# EAGLE design 411_SCH_FINAL (EAGLE 9.2.2)
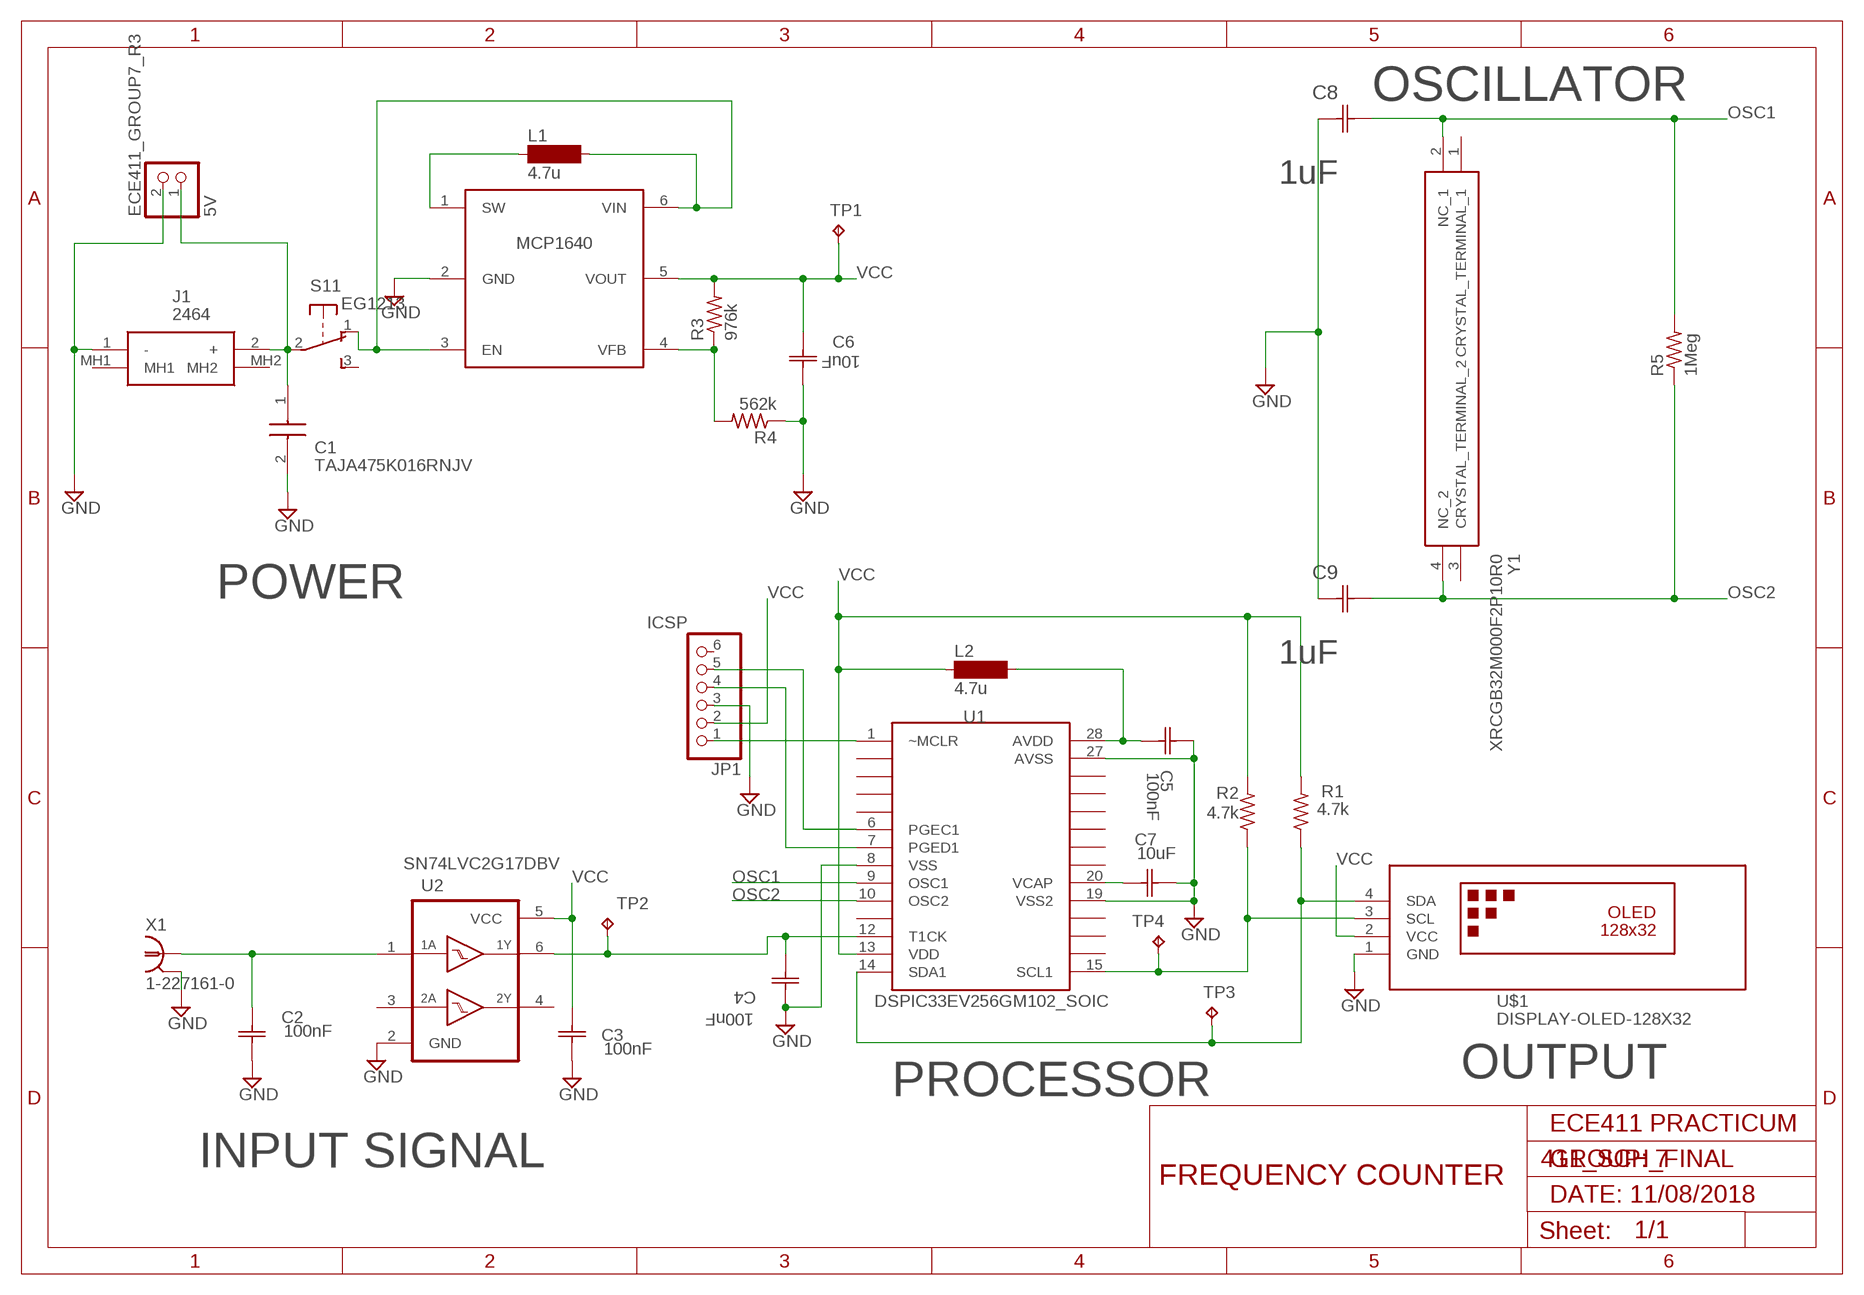
[diagram p0: schematic, sheet 1]

## Parts
C1  TAJA475K016RNJV  [CAPPM3216X180N]
C2  100nF  C0805C104K5RACTU  [CAPC2013X110N]
C3  100nF  C0805C104K5RACTU  [CAPC2013X110N]
C4  100nF  C0805C104K5RACTU  [CAPC2013X110N]
C5  100nF  C0805C104K5RACTU  [CAPC2013X110N]
C6  10uF  C0805C106K4PACTU  [CAPC2013X140N]
C7  10uF  C0805C106K4PACTU  [CAPC2013X140N]
C8  1uF  C0805C105K4RACTU  [CAPC2013X110N]
C9  1uF  C0805C105K4RACTU  [CAPC2013X110N]
ECE411_GROUP7_R3  5V  JST_2PIN-THM-RA  [JST-PH-2-THM-RA]
J1  2464  [2464]
JP1  ICSP  PINHD-1X6  [1X06]
L1  4.7u  SM-1206  [SM-1206]
L2  4.7u  SM-1206  [SM-1206]
MCP1  MCP1640  [SOP95P270X145-6]
R1  4.7k  R-US_M2012  [M2012]
R2  4.7k  R-US_M2012  [M2012]
R3  976k  R-US_R0805  [R0805]
R4  562k  R-US_R0805  [R0805]
R5  1Meg  R-US_M0805  [M0805]
S1  EG1213  [EG1213]
TP1  TPB1,27  [B1,27]
TP2  TPB1,27  [B1,27]
TP3  TPB1,27  [B1,27]
TP4  TPB1,27  [B1,27]
U1  DSPIC33EV256GM102_SOIC  [SOIC127P1020X265-28]
U2  SN74LVC2G17DBV  [SOT23-6]
U$1  DISPLAY-OLED-128X32  [DISPLAY-OLED-128X32]
X1  1-227161-0  [AMP_227161]
Y1  XRCGB32M000F2P10R0  [XRCGB32_F]

## Nets
BATT: L1.2 MCP1.3(EN) MCP1.6(VIN) S1.1(1:O)
GND: C1.2(-) C2.2(C2) C3.2(C2) C4.2(C2) C5.1(C1) C6.2(C2) C7.2(C2) C8.1(C1) C9.1(C1) ECE411_GROUP7_R3.2 J1.1(-) JP1.3 MCP1.2(GND) R4.1 U1.8(VSS) U1.19(VSS2) U1.27(AVSS) U2.2(GND) U$1.1(GND) X1.2
N$1: C7.1(C1) U1.20(VCAP)
N$2: C1.1(+) ECE411_GROUP7_R3.1 J1.2(+) S1.2(1:P)
N$5: R1.1 TP3.TP U1.14(SDA1) U$1.4(SDA)
N$6: C2.1(C1) U2.1(1A) X1.1
N$10: C5.2(C2) L2.2 U1.28(AVDD)
N$11: L1.1 MCP1.1(SW)
N$12: MCP1.4(VFB) R3.1 R4.2
N$14: JP1.1 U1.1(~MCLR)
N$15: R2.1 TP4.TP U1.15(SCL1) U$1.3(SCL)
N$16: JP1.4 U1.7(PGED1)
N$17: JP1.5 U1.6(PGEC1)
N$20: C4.1(C1) TP2.TP U1.12(T1CK) U2.6(1Y)
OSC1: C8.2(C2) R5.2 U1.9(OSC1) Y1.2(NC_1)
OSC2: C9.2(C2) R5.1 U1.10(OSC2) Y1.4(NC_2)
VCC: C3.1(C1) C6.1(C1) JP1.2 L2.1 MCP1.5(VOUT) R1.2 R2.2 R3.2 TP1.TP U1.13(VDD) U2.5(VCC) U$1.2(VCC)
Unconnected: J1.MH1 J1.MH2 JP1.6 S1.3(1:S) S1.MT1(MT) S1.MT2(MT) U1.2 U1.3 U1.4 U1.5 U1.11 U1.16 U1.17 U1.18 U1.21 U1.22 U1.23 U1.24 U1.25 U1.26 U2.3(2A) U2.4(2Y) Y1.1(CRYSTAL_TERMINAL_1) Y1.3(CRYSTAL_TERMINAL_2)

## Notes on the sheet
- OSCILLATOR
- POWER
- OUTPUT
- PROCESSOR
- ECE411 PRACTICUM
- INPUT SIGNAL | GROUP: 7
- FREQUENCY COUNTER
- DATE: 11/08/2018

## Library data of the parts
C1 = SamacSys_Parts:TAJA475K016RNJV: Tantalum Capacitors - Solid SMD 16V 4.7uF 10% 1206 ESR = 4 Ohms Source: Datasheet <https://componentsearchengine.com/Datasheets/1/TAJA475K016RNJV.pdf>; DESCRIPTION: Tantalum Capacitors - Solid SMD 16V 4.7uF 10% 1206 ESR = 4 Ohms; HEIGHT: 1.8mm; MANUFACTURER_NAME: AVX; MANUFACTURER_PART_NUMBER: TAJA475K016RNJV; MOUSER_PART_NUMBER: 581-TAJA475K016RNJV
C2-C5 = Kemet_By_element14_Batch_1:C0805C104K5RACTU: CAPACITOR, 0805; MPN: C0805C104K5RACTU; OC_FARNELL: 1414664; OC_NEWARK: 65H7431; SUPPLIER: Kemet; TOLERANCE: ±10%; VOLTAGERATING: 50V
C6 C7 = Kemet_By_element14_Batch_1:C0805C106K4PACTU: CAPACITOR, 0805; MPN: C0805C106K4PACTU; OC_FARNELL: 1288204; OC_NEWARK: 13M6695; SUPPLIER: Kemet; TOLERANCE: ±10%; VOLTAGERATING: 16V
C8 C9 = Kemet_By_element14_Batch_1:C0805C105K4RACTU: CAPACITOR, 0805; MPN: C0805C105K4RACTU; OC_FARNELL: 9227792; OC_NEWARK: 77C5351; SUPPLIER: Kemet; TOLERANCE: ±10%; VOLTAGERATING: 16V
ECE411_GROUP7_R3 = adafruit:JST_2PIN: JST 2-Pin Connectors of various flavors SMT-RA (S2B-PH-SM4) 4UConnector #17311 SMT (B2B-PH-SM4) THM-RA (S2B-PH) THM (B2B-PH); COST: 0.11; MFG: Harwin Inc.; MPN: M20-9990246; VENDOR: Digikey
J1 = SamacSys_Parts:2464: KEYSTONE - 2464. - BATTERY HOLDER Source: Datasheet <https://componentsearchengine.com/Datasheets/1/2464.pdf>; DESCRIPTION: KEYSTONE - 2464. - BATTERY HOLDER; HEIGHT: 16mm; MANUFACTURER_NAME: Keystone Electronics; MANUFACTURER_PART_NUMBER: 2464; MOUSER_PART_NUMBER: 534-2464
JP1 = adafruit:PINHD-1X6: PIN HEADER; COST: 0
L1 L2 = inductor-neosid:SM-1206: INDUCTOR SMD chip inductor; OC_FARNELL: unknown; OC_NEWARK: unknown
MCP1 = WBlib:MCP1640: MCP1640; COST: 0.59; MFG: Microchip Technology; MPN: MCP1640DT-I/CHY; VENDOR: Digikey
R1 R2 = adafruit:R-US_: RESISTOR, American symbol; COST: 0.1; MFG: Bourns; MPN: CR1206-JW-114ELF; VENDOR: Mouser
R3-R5 = adafruit:R-US_: RESISTOR, American symbol
S1 = adafruit:EG1213: E-Switch right-angle slide SPDT Part #EG1213 http://www.ladyada.net/library/eagle
TP1-TP4 = testpad:TP: Test pad; COST: 0
U1 = WBlib:DSPIC33EV256GM102: Microchip dsPIC33EV256GM102; COST: 3.67; MFG: Microchip Technology; MPN: DSPIC33EV256GM102; VENDOR: Digikey
U2 = SN74LVC2G17:SN74LVC2G17: DUAL SCHMITT-TRIGGER BUFFER; AVAILABILITY: Unavailable; COST: 0.42; DESCRIPTION: Dual Schmitt-Trigger Buffer; MF: Texas Instruments; MFG: ON semiconductor; MP: SN74LVC2G17; MPN: NC7WZ14P6X; PACKAGE: XFDFN-6 Texas Instruments; PRICE: None; VENDOR: Digikey
U$1 = diy-modules:DISPLAY-OLED-128X32: 128x32 Dot Matrix OLED Module with I2C interface based on SSD1306 chip More details available here: http://www.tinyosshop.com/index.php?route=product/product&product_id=953 Schematic available here: http://www.tinyosshop.com/datasheet/OLED%2012832.pdf SSD1306 datasheet: https://cdn-shop.adafruit.com/datasheets/SSD1306.pdf Click here to find device on ebay.com <http://www.ebay.com/sch/oled+display+128x32+i2c>; COST: 5.50; MFG: Generic; MPN: SSD1306; VENDOR: Amazon
X1 = con-coax:?227161*: JACK, RIGHT ANGLE, 50 OHM, PCB, BNC Source: amp_227161.pdf; MF: TYCO ELECTRONICS; MPN: 1-227161; OC_FARNELL: unknown; OC_NEWARK: 33B3200
Y1 = SamacSys_Parts:XRCGB32M000F2P10R0: Crystals 32.0MHz 20ppm Tol. Temp Shift 20ppm Source: Datasheet <https://componentsearchengine.com/Datasheets/1/XRCGB32M000F2P10R0.pdf>; DESCRIPTION: Crystals 32.0MHz 20ppm Tol. Temp Shift 20ppm; HEIGHT: mm; MANUFACTURER_NAME: Murata Electronics; MANUFACTURER_PART_NUMBER: XRCGB32M000F2P10R0; MOUSER_PART_NUMBER: 81-XRCGB32M000F2P1R0

## Board
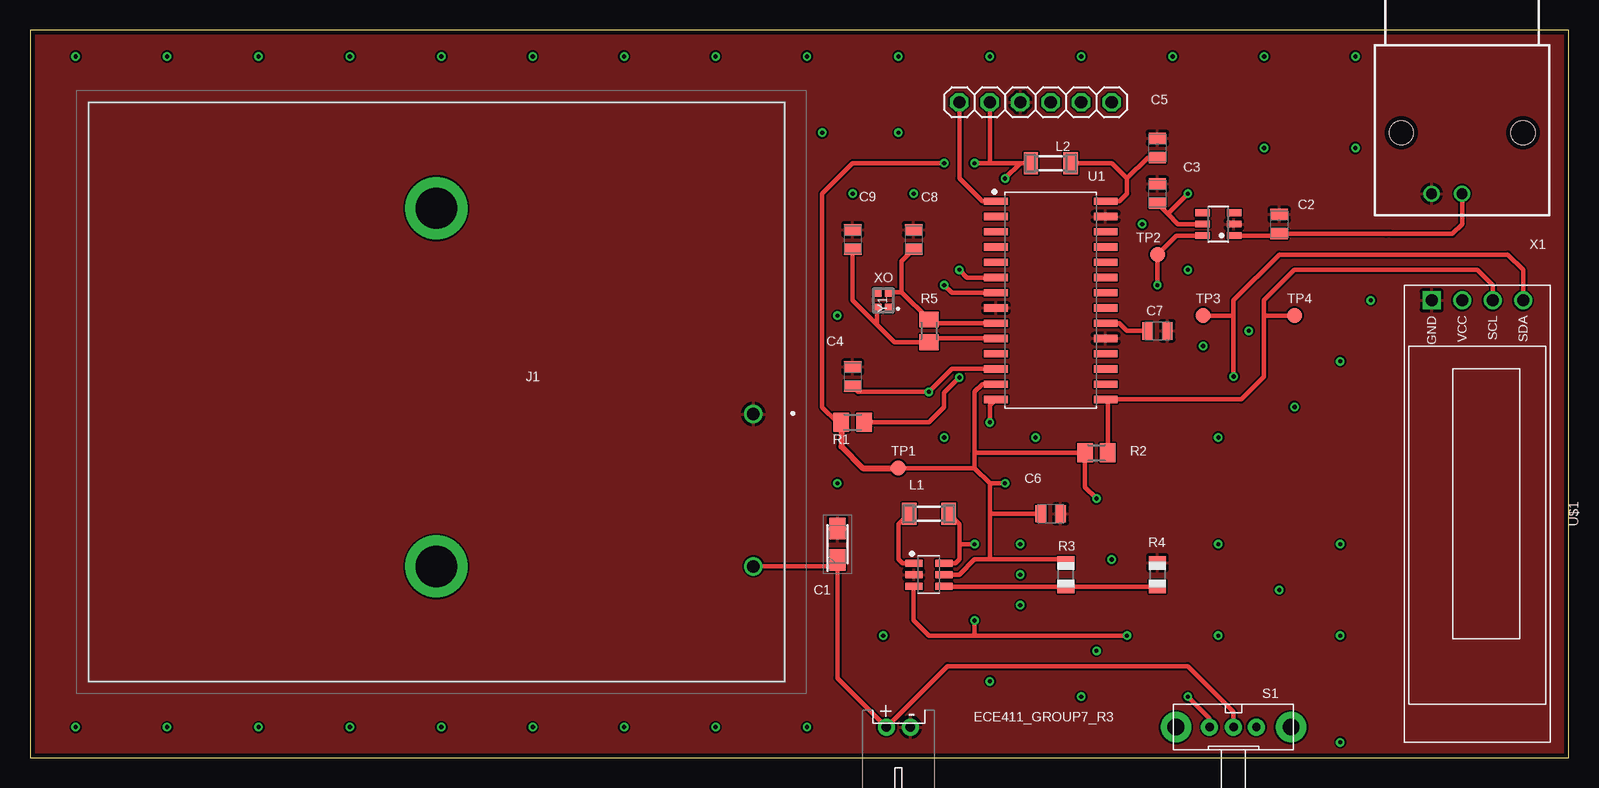
[diagram p1: board, top side]
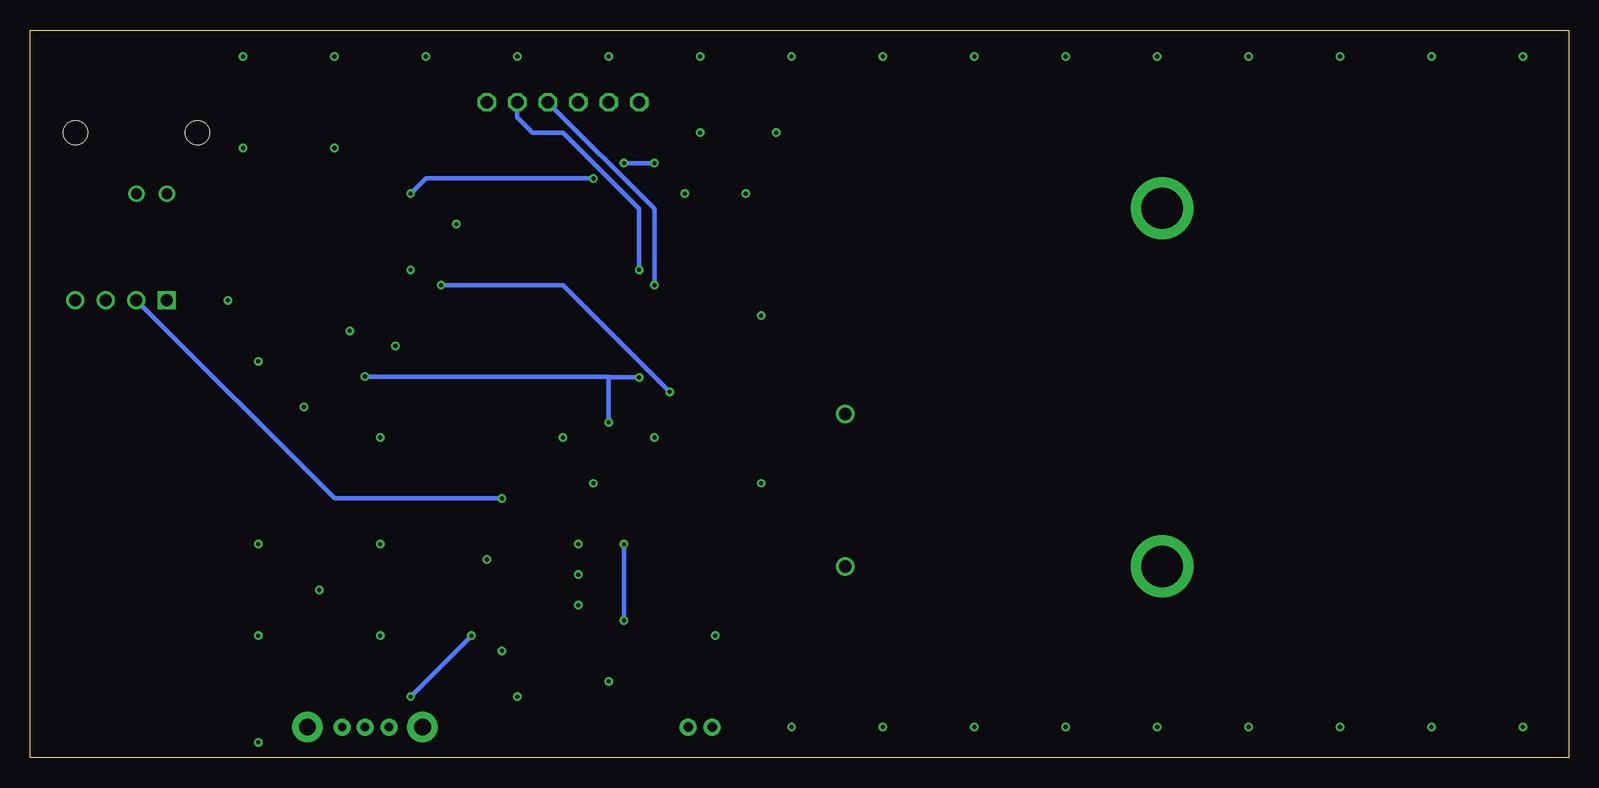
[diagram p2: board, bottom side, seen from below]

Size 128.25 x 60.63 mm. Coordinates in mm from the lower left corner, seen from the top.
Outline: 0,0 128.25,0 128.25,60.63 0,60.63 0,0
Copper layers (1*16): Top 0.0356mm / dielectric 1.5011mm / Bottom 0.0356mm
Design rules "LaenPCBOrder": minimum track width 6mil, minimum drill 13mil, track to track 6mil, track to pad 6mil, pad to pad 6mil, via to via 6mil, smd to smd 6mil, copper to edge 15mil, drill to drill 6mil, minimum pad ring 7mil, minimum via ring 7mil, stop-mask expansion 3mil, vias tented up to drill 0mil, thermal gap 10mil

### Footprints (pad centres in the part's own frame; a part is rotated, then mirrored left to right if it is on the bottom)
CAPPM3216X180N = smd 1.8 x 1.3: 1 -1.3,0; 2 1.3,0
CAPC2013X110N = smd 0.914 x 1.448: 1 -0.813,0; 2 0.813,0
CAPC2013X140N = smd 0.914 x 1.448: 1 -0.813,0; 2 0.813,0
JST-PH-2-THM-RA = drill 0.8 pad 1.422: 1 1,0; 2 -1,0
2464 = drill 1.02 pad 1.53: 1 26.005,-1.85; 2 26.005,-14.55 | drill 3.45 pad 5.175: MH1 -0.415,-14.55; MH2 -0.415,15.3
1X06 = drill 1.016 octagon: 1 -6.35,0; 2 -3.81,0; 3 -1.27,0; 4 1.27,0; 5 3.81,0; 6 6.35,0
SM-1206 = smd 1.2 x 1.8: 1 -1.65,0; 2 1.65,0
SOP95P270X145-6 = smd 1.412 x 0.59: 1 -1.247,0.95; 2 -1.247,0; 3 -1.247,-0.95; 4 1.247,-0.95; 5 1.247,0; 6 1.247,0.95
M2012 = smd 1.3 x 1.6: 1 -0.95,0; 2 0.95,0
R0805 = smd 1.1 x 1.4: 1 -1,0; 2 1,0
M0805 = smd 1.3 x 1.6: 1 -0.95,0; 2 0.95,0
EG1213 = drill 0.7 pad 1.422: 1 -2,0; 2 0,0; 3 1.9,0 | drill 1.4 pad 2.54: MT1 -4.8,0; MT2 4.8,0
B1,27 = smd 1.27 x 1.27: TP 0,0
SOIC127P1020X265-28 = smd 1.968 x 0.599: 1 -4.573,8.255; 2 -4.573,6.985; 3 -4.573,5.715; 4 -4.573,4.445; 5 -4.573,3.175; 6 -4.573,1.905; 7 -4.573,0.635; 8 -4.573,-0.635; 9 -4.573,-1.905; 10 -4.573,-3.175; 11 -4.573,-4.445; 12 -4.573,-5.715; 13 -4.573,-6.985; 14 -4.573,-8.255; 15 4.573,-8.255; 16 4.573,-6.985; 17 4.573,-5.715; 18 4.573,-4.445; 19 4.573,-3.175; 20 4.573,-1.905; 21 4.573,-0.635; 22 4.573,0.635; 23 4.573,1.905; 24 4.573,3.175; 25 4.573,4.445; 26 4.573,5.715; 27 4.573,6.985; 28 4.573,8.255
SOT23-6 = smd 0.55 x 1.2: 1 -0.95,-1.3; 2 0,-1.3; 3 0.95,-1.3; 4 0.95,1.3; 5 0,1.3; 6 -0.95,1.3
DISPLAY-OLED-128X32 = drill 1 square: 1 -17.78,-3.81 | drill 1: 2 -17.78,-1.27; 3 -17.78,1.27; 4 -17.78,3.81
AMP_227161 = drill 0.9 pad 1.27: 1 0,-5.08; 2 -2.54,-5.08 | hole 2: -5.08,0; 5.08,0
XRCGB32_F = smd 0.75 x 0.7: 1 -0.675,-0.5; 2 0.675,-0.5; 3 0.675,0.5; 4 -0.675,0.5

### Placement (x,y rotation side)
C1  67.31,17.78 90 top
C2  104.14,44.45 90 top
C3  93.98,46.99 90 top
C4  68.58,31.75 90 top
C5  93.98,50.8 270 top
C6  85.09,20.32 0 top
C7  93.98,35.56 0 top
C8  73.66,43.18 270 top
C9  68.58,43.18 270 top
ECE411_GROUP7_R3  72.39,2.54 180 top
J1  34.29,30.48 0 top
JP1  83.82,54.61 0 top
L1  74.93,20.32 0 top
L2  85.09,49.53 0 top
MCP1  74.93,15.24 0 top
R1  68.58,27.94 180 top
R2  88.9,25.4 180 top
R3  86.36,15.24 90 top
R4  93.98,15.24 270 top
R5  74.93,35.56 90 top
S1  100.33,2.54 0 top
TP1  72.39,24.13 0 top
TP2  93.98,41.91 0 top
TP3  97.79,36.83 0 top
TP4  105.41,36.83 0 top
U1  85.09,38.1 0 top
U2  99.06,44.45 90 top
U$1  120.65,20.32 270 top
X1  119.38,52.07 0 top
Y1  71.12,38.1 90 top

### Tracks (layer width: path | path; a pad name or v marks a point on that pad's centre or on a via)
BATT  (via drill 0.35)
  Top 0.356: MCP1.6 77.15,16.19 77.47,16.51 77.47,17.78 | L1.2 77.47,19.43 77.47,17.78 | S1.1 98.33,3.27 v96.52,5.08 | v91.44,10.16 78.74,10.16 | 78.74,10.16 74.93,10.16 73.66,11.43 73.66,14.27 MCP1.3 | 77.47,17.78 v78.74,17.78 | v78.74,11.43 78.74,10.16
  Bottom 0.356: v96.52,5.08 v91.44,10.16 | v78.74,17.78 v78.74,11.43
GND
  pour Top: -1.27,62.23 -1.27,-1.27 129.54,-1.27 129.54,62.23
N$1
  Top 0.356: U1.20 90.8,36.2 91.44,35.56 C7.1
N$2
  Top 0.356: J1.2 66.76,15.93 C1.1 67.31,6.62 ECE411_GROUP7_R3.1 76.47,7.62 96.52,7.62 100.33,3.81 S1.2
N$3  (via drill 0.35)
  other vias: 110.49,58.42
N$4  (via drill 0.35)
  other vias: 110.49,50.8
N$5  (via drill 0.35)
  Top 0.356: 100.33,36.83 100.33,38.1 104.14,41.91 123.19,41.91 124.46,40.64 U$1.4 | 100.33,36.83 v100.33,31.75 | TP3.TP 100.33,36.83 | U1.14 80.01,29.34 v80.01,27.94 | R1.1 74.93,27.94 76.2,29.21 76.2,30.41 v77.47,31.68
  Bottom 0.356: v100.33,31.75 80.01,31.75 | v80.01,27.94 80.01,31.75 | 80.01,31.75 79.94,31.68 v77.47,31.68
N$6
  Top 0.356: U2.1 104,43.5 C2.1 113.03,43.64 113.49,43.64 118.57,43.64 119.38,44.45 X1.1
N$7  (via drill 0.35)
  other vias: 3.81,58.42
N$8  (via drill 0.35)
  other vias: 102.87,50.8
N$9  (via drill 0.35)
  other vias: 72.39,52.07
N$10
  Top 0.356: U1.28 90.8,46.35 91.44,46.99 91.44,48.26 | 91.44,48.26 90.17,49.53 L2.2 | 91.44,48.26 93.17,49.99 C5.2
N$11
  Top 0.356: MCP1.1 72.71,16.19 72.39,16.51 72.39,19.43 L1.1
N$12
  Top 0.356: MCP1.4 76.23,14.24 R3.1 R4.2
N$13  (via drill 0.35)
  other vias: 11.43,58.42
N$14
  Top 0.356: JP1.1 77.47,48.26 79.38,46.35 U1.1
N$15
  Top 0.356: 102.87,36.83 102.87,38.1 105.41,40.64 120.65,40.64 121.92,39.37 U$1.3 | TP4.TP 102.87,36.83 | 102.87,36.83 102.87,31.75 100.96,29.84 U1.15 89.85,29.66 R2.1
N$16  (via drill 0.35)
  Top 0.356: v76.2,39.37 76.83,38.73 U1.7
  Bottom 0.356: JP1.4 76.2,45.72 v76.2,39.37
N$17  (via drill 0.35)
  Top 0.356: U1.6 78.1,40 v77.47,40.64
  Bottom 0.356: v77.47,40.64 77.47,45.72 83.82,52.07 86.36,52.07 87.63,53.34 JP1.5
N$18  (via drill 0.35)
  other vias: 66.04,52.07
N$19  (via drill 0.35)
  other vias: 19.05,58.42
N$20  (via drill 0.35)
  Top 0.356: U2.6 95.57,43.5 TP2.TP v93.98,39.37 | C4.1 69.04,30.48 v74.93,30.48 76.83,32.38 U1.12
  Bottom 0.356: v93.98,39.37 83.82,39.37 v74.93,30.48
N$21  (via drill 0.35)
  other vias: 68.58,46.99
N$22  (via drill 0.35)
  other vias: 26.67,58.42
N$23  (via drill 0.35)
  other vias: 73.66,46.99
N$24  (via drill 0.35)
  other vias: 34.29,58.42
N$25  (via drill 0.35)
  other vias: 41.91,58.42
N$26  (via drill 0.35)
  other vias: 49.53,58.42
N$27  (via drill 0.35)
  other vias: 57.15,58.42
N$28  (via drill 0.35)
  other vias: 3.81,2.54
N$29  (via drill 0.35)
  other vias: 11.43,2.54
N$30  (via drill 0.35)
  other vias: 19.05,2.54
N$31  (via drill 0.35)
  other vias: 26.67,2.54
N$32  (via drill 0.35)
  other vias: 34.29,2.54
N$33  (via drill 0.35)
  other vias: 41.91,2.54
N$34  (via drill 0.35)
  other vias: 49.53,2.54
N$35  (via drill 0.35)
  other vias: 57.15,2.54
N$36  (via drill 0.35)
  other vias: 64.77,2.54
N$37  (via drill 0.35)
  other vias: 64.77,58.42
N$38  (via drill 0.35)
  other vias: 72.39,58.42
N$39  (via drill 0.35)
  other vias: 80.01,58.42
N$40  (via drill 0.35)
  other vias: 87.63,58.42
N$41  (via drill 0.35)
  other vias: 95.25,58.42
N$42  (via drill 0.35)
  other vias: 102.87,58.42
N$43  (via drill 0.35)
  other vias: 67.31,36.83
N$44  (via drill 0.35)
  other vias: 76.2,26.67
N$45  (via drill 0.35)
  other vias: 67.31,22.86
N$46  (via drill 0.35)
  other vias: 71.12,10.16
N$47  (via drill 0.35)
  other vias: 88.9,8.89
N$48  (via drill 0.35)
  other vias: 87.63,5.08
N$49  (via drill 0.35)
  other vias: 99.06,10.16
N$50  (via drill 0.35)
  other vias: 109.22,10.16
N$51  (via drill 0.35)
  other vias: 109.22,1.27
N$52  (via drill 0.35)
  other vias: 109.22,17.78
N$53  (via drill 0.35)
  other vias: 99.06,17.78
N$54  (via drill 0.35)
  other vias: 99.06,26.67
N$55  (via drill 0.35)
  other vias: 109.22,33.02
N$56  (via drill 0.35)
  other vias: 97.79,34.29
N$57  (via drill 0.35)
  other vias: 83.82,26.67
N$58  (via drill 0.35)
  other vias: 82.55,17.78
N$59  (via drill 0.35)
  other vias: 82.55,15.24
N$60  (via drill 0.35)
  other vias: 82.55,12.7
N$61  (via drill 0.35)
  other vias: 90.17,16.51
N$62  (via drill 0.35)
  other vias: 111.76,38.1
N$63  (via drill 0.35)
  other vias: 105.41,29.21
N$64  (via drill 0.35)
  other vias: 96.52,40.64
N$65  (via drill 0.35)
  other vias: 92.71,44.45
N$66  (via drill 0.35)
  other vias: 101.6,35.56
N$67  (via drill 0.35)
  other vias: 104.14,13.97
N$68  (via drill 0.35)
  other vias: 80.01,6.35
OSC1
  Top 0.356: U1.9 75.24,36.2 R5.2 72.66,38.77 | 72.66,38.77 Y1.2 | 72.66,38.77 72.66,41.37 C8.2
OSC2
  Top 0.356: U1.10 75.24,34.92 R5.1 72.07,34.61 70.62,36.06 | 70.62,36.06 Y1.4 | 70.62,36.06 68.58,38.1 C9.2
VCC  (via drill 0.35)
  Top 0.356: R3.2 86.36,16.51 80.01,16.51 | 80.01,16.51 80.01,20.32 | 80.01,20.32 80.01,22.86 | 80.01,22.86 78.74,24.13 | 78.74,24.13 TP1.TP | 80.01,20.32 C6.1 | MCP1.5 77.47,15.24 78.74,16.51 80.01,16.51 | 78.74,25.4 R2.2 87.95,22.54 v88.9,21.59 | L2.1 82.55,49.53 | 82.55,49.53 80.01,49.53 | 80.01,49.53 v78.74,49.53 | v76.2,49.53 68.58,49.53 66.04,46.99 66.04,29.21 67.31,27.94 R1.2 | 78.74,24.13 78.74,25.4 | 80.01,22.86 v81.28,22.86 | U1.13 79.38,31.11 78.74,30.48 78.74,25.4 | JP1.2 80.01,49.53 | U2.5 95.71,44.45 94.84,45.31 | 94.84,45.31 C3.1 | 82.55,49.53 v81.28,48.26 | v96.52,46.99 94.84,45.31
  Top 0.508: R1.2 67.63,25.94 69.44,24.13 TP1.TP
  Bottom 0.356: v78.74,49.53 v76.2,49.53 | U$1.2 102.87,21.59 v88.9,21.59 | v81.28,48.26 95.25,48.26 v96.52,46.99

### Text on the board
tPlace: XO